# Altium schematic sheet Main.SchDoc
size A; SheetNumber: 1; SheetTotal: 3
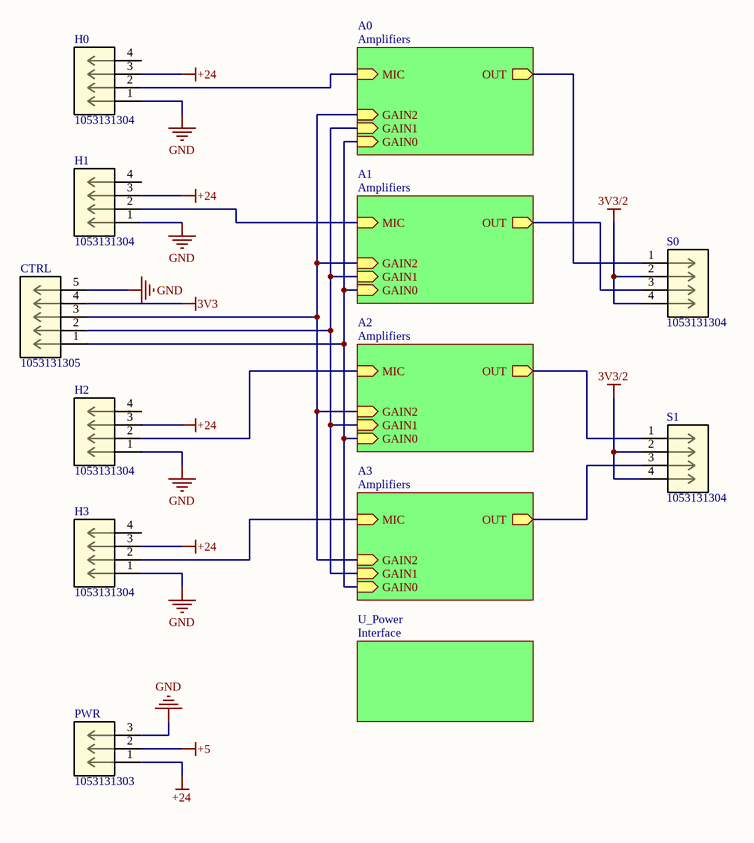
[diagram p0: Main.SchDoc]

## Parts
CTRL  1053131305  [CON_1053131305]
H0  1053131304  [CON_1053131304]
H1  1053131304  [CON_1053131304]
H2  1053131304  [CON_1053131304]
H3  1053131304  [CON_1053131304]
PWR  1053131303  [CON_1053131303]
S0  1053131304  [CON_1053131304]
S1  1053131304  [CON_1053131304]

## Sub-sheets
A0 = Amplifiers: GAIN0 (in), GAIN1 (in), GAIN2 (in), MIC (in), OUT (out)
A1 = Amplifiers: GAIN0 (in), GAIN1 (in), GAIN2 (in), MIC (in), OUT (out)
A2 = Amplifiers: GAIN0 (in), GAIN1 (in), GAIN2 (in), MIC (in), OUT (out)
A3 = Amplifiers: GAIN0 (in), GAIN1 (in), GAIN2 (in), MIC (in), OUT (out)
U_Power = Interface: no entries

## Nets
3V3: CTRL.4
3V3/2: S0.2 S0.4 S1.2 S1.4
+5: PWR.2
+24: H0.3 H1.3 H2.3 H3.3 PWR.1
GND: CTRL.5 H0.1 H1.1 H2.1 H3.1 PWR.3
NetCTRL_1: CTRL.1 ; sheet A0/GAIN0, sheet A1/GAIN0, sheet A2/GAIN0, sheet A3/GAIN0
NetCTRL_2: CTRL.2 ; sheet A0/GAIN1, sheet A1/GAIN1, sheet A2/GAIN1, sheet A3/GAIN1
NetCTRL_3: CTRL.3 ; sheet A0/GAIN2, sheet A1/GAIN2, sheet A2/GAIN2, sheet A3/GAIN2
NetH0_2: H0.2 ; sheet A0/MIC
NetH1_2: H1.2 ; sheet A1/MIC
NetH2_2: H2.2 ; sheet A2/MIC
NetH3_2: H3.2 ; sheet A3/MIC
NetS0_1: S0.1 ; sheet A0/OUT
NetS0_3: S0.3 ; sheet A1/OUT
NetS1_1: S1.1 ; sheet A2/OUT
NetS1_3: S1.3 ; sheet A3/OUT

Not connected (* = marked no-connect by the designer): H0 4; H1 4; H2 4; H3 4

## Library data of the parts
CTRL = 1053131305: No Description Available; Mfr_Name: Molex Connector Corporation; Copyright: Copyright (C) 2023 Ultra Librarian. All rights reserved.; Manufacturer_Part_Number: 1053131305; RefDes: RefDes; Type: DEV
H0-H3 S0 S1 = 1053131304: No Description Available; Mfr_Name: Molex Connector Corporation; Copyright: Copyright (C) 2023 Ultra Librarian. All rights reserved.; Manufacturer_Part_Number: 1053131304; RefDes: RefDes; Type: DEV
PWR = 1053131303: No Description Available; Mfr_Name: Molex Connector Corporation; Copyright: Copyright (C) 2023 Ultra Librarian. All rights reserved.; Manufacturer_Part_Number: 1053131303; RefDes: RefDes; Type: DEV